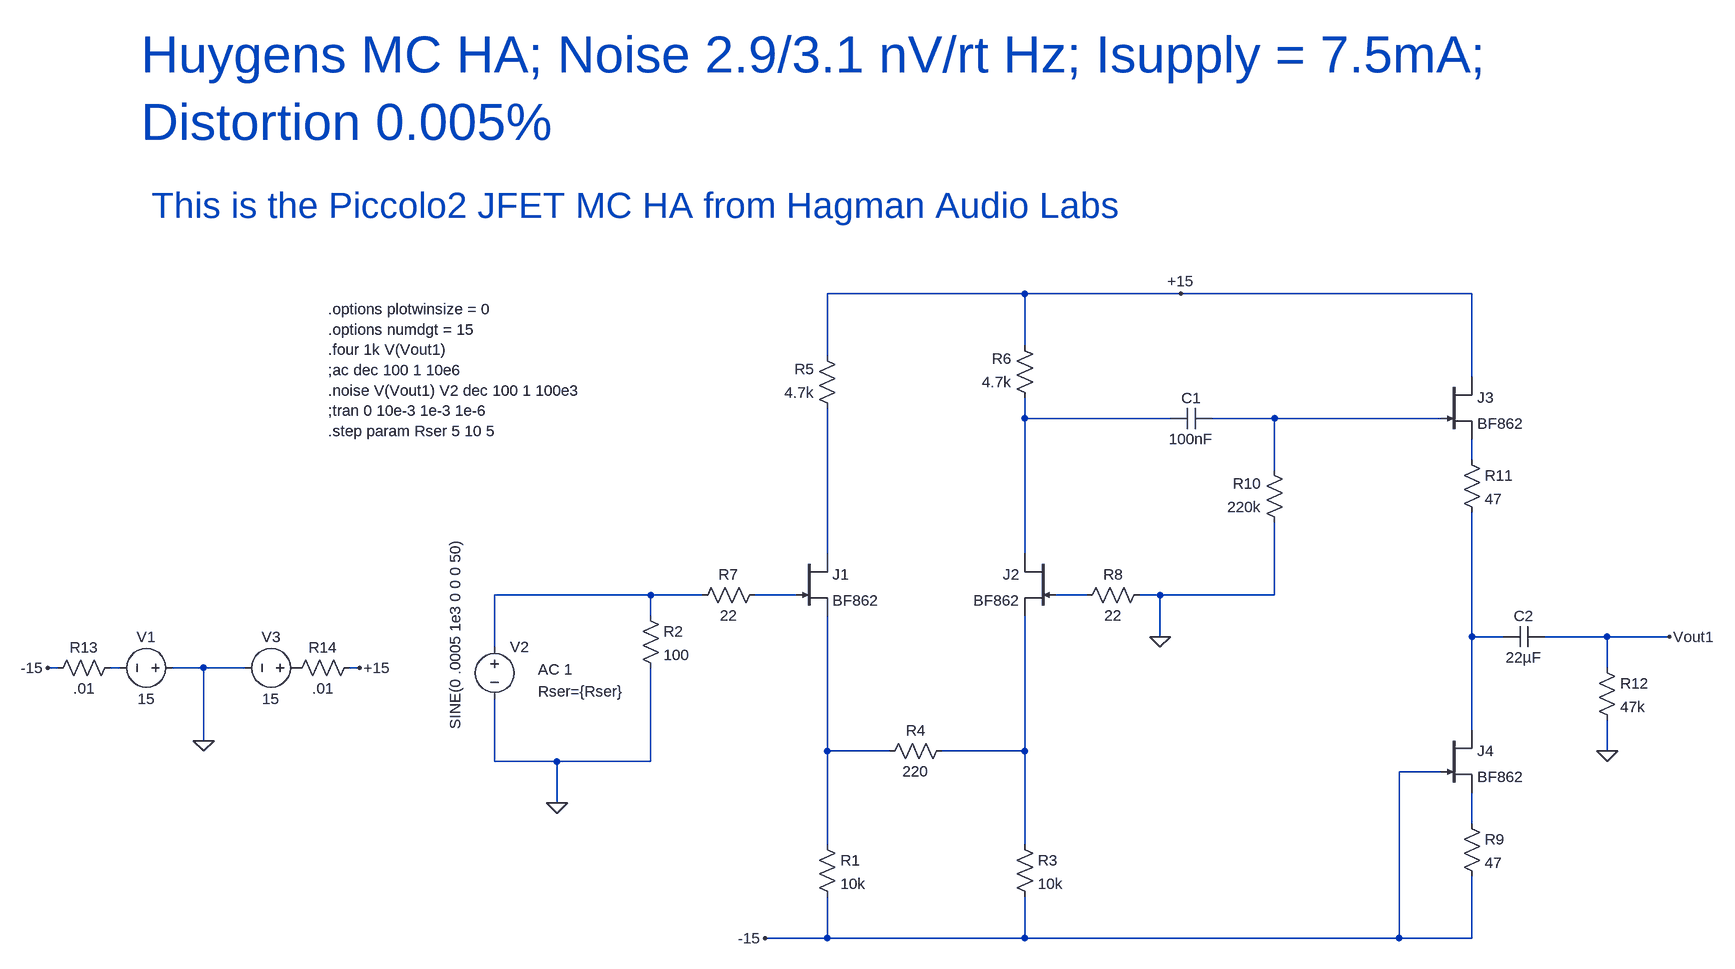
[diagram p0: schematic Huygens.asc]
Huygens.asc, the LTspice schematic file:
Version 4
SHEET 1 2356 680
WIRE 912 -704 608 -704
WIRE 1152 -704 912 -704
WIRE 1600 -704 1152 -704
WIRE 912 -624 912 -704
WIRE 608 -608 608 -704
WIRE 1600 -576 1600 -704
WIRE 912 -512 912 -544
WIRE 1136 -512 912 -512
WIRE 1296 -512 1200 -512
WIRE 1552 -512 1296 -512
WIRE 1600 -448 1600 -480
WIRE 1296 -432 1296 -512
WIRE 608 -304 608 -528
WIRE 912 -304 912 -512
WIRE 336 -240 96 -240
WIRE 416 -240 336 -240
WIRE 560 -240 496 -240
WIRE 1008 -240 960 -240
WIRE 1120 -240 1088 -240
WIRE 1296 -240 1296 -352
WIRE 1296 -240 1120 -240
WIRE 336 -208 336 -240
WIRE 1120 -176 1120 -240
WIRE 1600 -176 1600 -368
WIRE 1648 -176 1600 -176
WIRE 1808 -176 1712 -176
WIRE 1904 -176 1808 -176
WIRE 96 -160 96 -240
WIRE -576 -128 -592 -128
WIRE -480 -128 -496 -128
WIRE -352 -128 -400 -128
WIRE -288 -128 -352 -128
WIRE -112 -128 -128 -128
WIRE 1808 -128 1808 -176
WIRE 1600 -32 1600 -176
WIRE -352 -16 -352 -128
WIRE 608 0 608 -208
WIRE 704 0 608 0
WIRE 912 0 912 -208
WIRE 912 0 784 0
WIRE 1808 0 1808 -48
WIRE 96 16 96 -80
WIRE 192 16 96 16
WIRE 336 16 336 -128
WIRE 336 16 192 16
WIRE 1552 32 1488 32
WIRE 192 80 192 16
WIRE 1600 112 1600 64
WIRE 608 144 608 0
WIRE 912 144 912 0
WIRE 608 288 608 224
WIRE 608 288 512 288
WIRE 912 288 912 224
WIRE 912 288 608 288
WIRE 1488 288 1488 32
WIRE 1488 288 912 288
WIRE 1600 288 1600 192
WIRE 1600 288 1488 288
FLAG -352 -16 0
FLAG 1904 -176 Vout1
FLAG 1120 -176 0
FLAG -112 -128 +15
FLAG 1152 -704 +15
FLAG -592 -128 -15
FLAG 512 288 -15
FLAG 1808 0 0
FLAG 192 80 0
SYMBOL njf 560 -304 R0
SYMATTR InstName J1
SYMATTR Value BF862
SYMBOL res 592 128 R0
SYMATTR InstName R1
SYMATTR Value 10k
SYMBOL voltage -384 -128 R90
WINDOW 0 -32 56 VBottom 2
WINDOW 3 32 56 VTop 2
WINDOW 123 2 56 VBottom 2
WINDOW 39 0 0 Left 2
SYMATTR InstName V1
SYMATTR Value 15
SYMBOL voltage 96 -176 R0
WINDOW 3 -61 -152 VRight 2
WINDOW 123 67 50 Left 2
WINDOW 39 67 84 Left 2
SYMATTR Value SINE(0 .0005 1e3 0 0 0 50)
SYMATTR Value2 AC 1
SYMATTR SpiceLine Rser={Rser}
SYMATTR InstName V2
SYMBOL res 320 -224 R0
SYMATTR InstName R2
SYMATTR Value 100
SYMBOL njf 960 -304 M0
SYMATTR InstName J2
SYMATTR Value BF862
SYMBOL res 896 128 R0
SYMATTR InstName R3
SYMATTR Value 10k
SYMBOL res 800 -16 R90
WINDOW 0 0 56 VBottom 2
WINDOW 3 32 56 VTop 2
SYMATTR InstName R4
SYMATTR Value 220
SYMBOL res 624 -512 R180
WINDOW 0 36 76 Left 2
WINDOW 3 36 40 Left 2
SYMATTR InstName R5
SYMATTR Value 4.7k
SYMBOL res 928 -528 R180
WINDOW 0 36 76 Left 2
WINDOW 3 36 40 Left 2
SYMATTR InstName R6
SYMATTR Value 4.7k
SYMBOL res 512 -256 R90
WINDOW 0 0 56 VBottom 2
WINDOW 3 32 56 VTop 2
SYMATTR InstName R7
SYMATTR Value 22
SYMBOL res 1104 -256 R90
WINDOW 0 0 56 VBottom 2
WINDOW 3 32 56 VTop 2
SYMATTR InstName R8
SYMATTR Value 22
SYMBOL njf 1552 -576 R0
SYMATTR InstName J3
SYMATTR Value BF862
SYMBOL njf 1552 -32 R0
SYMATTR InstName J4
SYMATTR Value BF862
SYMBOL res 1584 96 R0
SYMATTR InstName R9
SYMATTR Value 47
SYMBOL res 1312 -336 R180
WINDOW 0 36 76 Left 2
WINDOW 3 36 40 Left 2
SYMATTR InstName R10
SYMATTR Value 220k
SYMBOL cap 1200 -528 R90
WINDOW 0 0 32 VBottom 2
WINDOW 3 32 32 VTop 2
SYMATTR InstName C1
SYMATTR Value 100nF
SYMBOL res 1584 -464 R0
SYMATTR InstName R11
SYMATTR Value 47
SYMBOL voltage -192 -128 R90
WINDOW 0 -32 56 VBottom 2
WINDOW 3 32 56 VTop 2
WINDOW 123 2 56 VBottom 2
WINDOW 39 0 0 Left 2
SYMATTR InstName V3
SYMATTR Value 15
SYMBOL cap 1648 -192 M90
WINDOW 0 0 32 VBottom 2
WINDOW 3 32 32 VTop 2
SYMATTR InstName C2
SYMATTR Value 22µF
SYMBOL res 1792 -144 R0
SYMATTR InstName R12
SYMATTR Value 47k
SYMBOL res -480 -144 R90
WINDOW 0 0 56 VBottom 2
WINDOW 3 32 56 VTop 2
SYMATTR InstName R13
SYMATTR Value .01
SYMBOL res -112 -144 R90
WINDOW 0 0 56 VBottom 2
WINDOW 3 32 56 VTop 2
SYMATTR InstName R14
SYMATTR Value .01
TEXT -160 -680 Left 2 !.options plotwinsize = 0\n.options numdgt = 15\n.four 1k V(Vout1)\n;ac dec 100 1 10e6\n.noise V(Vout1) V2 dec 100 1 100e3\n;tran 0 10e-3 1e-3 1e-6\n.step param Rser 5 10 5
TEXT -448 -1072 Left 6 ;Huygens MC HA; Noise 2.9/3.1 nV/rt Hz; Isupply = 7.5mA; \nDistortion 0.005%
TEXT -432 -840 Left 5 ;This is the Piccolo2 JFET MC HA from Hagman Audio Labs

The netlist it stands for:
* Huygens.asc
J1 N004 N006 N010 BF862
R1 N010 -15 10k
V1 0 N009 15
V2 N005 0 SINE(0 .0005 1e3 0 0 0 50) AC 1 Rser={Rser}
R2 N005 0 100
J2 N001 N007 N011 BF862
R3 N011 -15 10k
R4 N011 N010 220
R5 N004 +15 4.7k
R6 N001 +15 4.7k
R7 N006 N005 22
R8 0 N007 22
J3 +15 N002 N003 BF862
J4 N008 -15 N012 BF862
R9 N012 -15 47
R10 0 N002 220k
C1 N002 N001 100nF
R11 N003 N008 47
V3 P001 0 15
C2 N008 Vout1 22µF
R12 Vout1 0 47k
R13 N009 -15 .01
R14 +15 P001 .01
.model NJF NJF
.model PJF PJF
.lib standard.jft
.options plotwinsize = 0
.options numdgt = 15
.four 1k V(Vout1)
;ac dec 100 1 10e6
.noise V(Vout1) V2 dec 100 1 100e3
;tran 0 10e-3 1e-3 1e-6
.step param Rser 5 10 5
* Huygens MC HA; Noise 2.9/3.1 nV/rt Hz; Isupply = 7.5mA;
* Distortion 0.005%
* This is the Piccolo2 JFET MC HA from Hagman Audio Labs
.backanno
.end